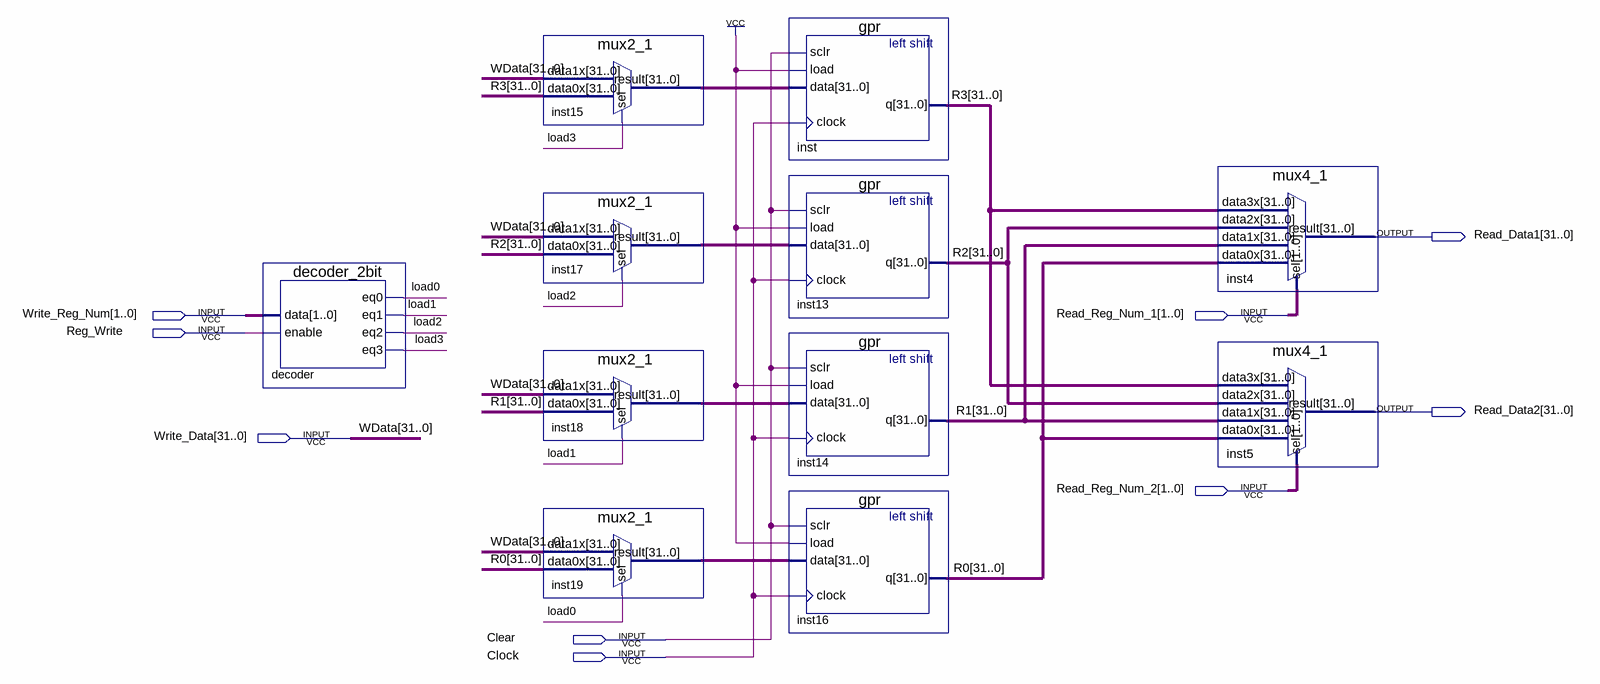
[diagram p0: schematic sheet]
// Quartus schematic RegisterFile_4_32bit.bdf as structural Verilog: 11 symbols, 9 pins
module RegisterFile_4_32bit (
  input  [1:0] Write_Reg_Num,
  input  [1:0] Read_Reg_Num_1,
  input  Reg_Write,
  input  [31:0] Write_Data,
  input  [1:0] Read_Reg_Num_2,
  input  Clear,
  input  Clock,
  output [31:0] Read_Data1,
  output [31:0] Read_Data2
);

  wire load0, load1, load2, load3;
  wire [31:0] inst15_result, inst17_result, inst18_result, inst19_result, R0, R1, R2, R3;

  decoder_2bit decoder (.data(Write_Reg_Num), .enable(Reg_Write), .eq0(load0), .eq1(load1), .eq2(load2), .eq3(load3));
  mux2_1 inst15 (.data1x(Write_Data), .data0x(R3), .sel(load3), .result(inst15_result));
  mux2_1 inst17 (.data1x(Write_Data), .data0x(R2), .sel(load2), .result(inst17_result));
  mux2_1 inst18 (.data1x(Write_Data), .data0x(R1), .sel(load1), .result(inst18_result));
  mux2_1 inst19 (.data1x(Write_Data), .data0x(R0), .sel(load0), .result(inst19_result));
  gpr inst (.sclr(Clear), .load(1'b1), .data(inst15_result), .clock(Clock), .q(R3));
  gpr inst13 (.sclr(Clear), .load(1'b1), .data(inst17_result), .clock(Clock), .q(R2));
  gpr inst14 (.sclr(Clear), .load(1'b1), .data(inst18_result), .clock(Clock), .q(R1));
  gpr inst16 (.sclr(Clear), .load(1'b1), .data(inst19_result), .clock(Clock), .q(R0));
  mux4_1 inst4 (.data3x(R3), .data2x(R2), .data1x(R1), .data0x(R0), .sel(Read_Reg_Num_1), .result(Read_Data1));
  mux4_1 inst5 (.data3x(R3), .data2x(R2), .data1x(R1), .data0x(R0), .sel(Read_Reg_Num_2), .result(Read_Data2));

  // Other names for the same wires on the sheet: WData[31:0] = Write_Data
endmodule
